# EAGLE schematic mother_card_cs_956pm (EAGLE 8.2.2)

## Sheet 1 of 2
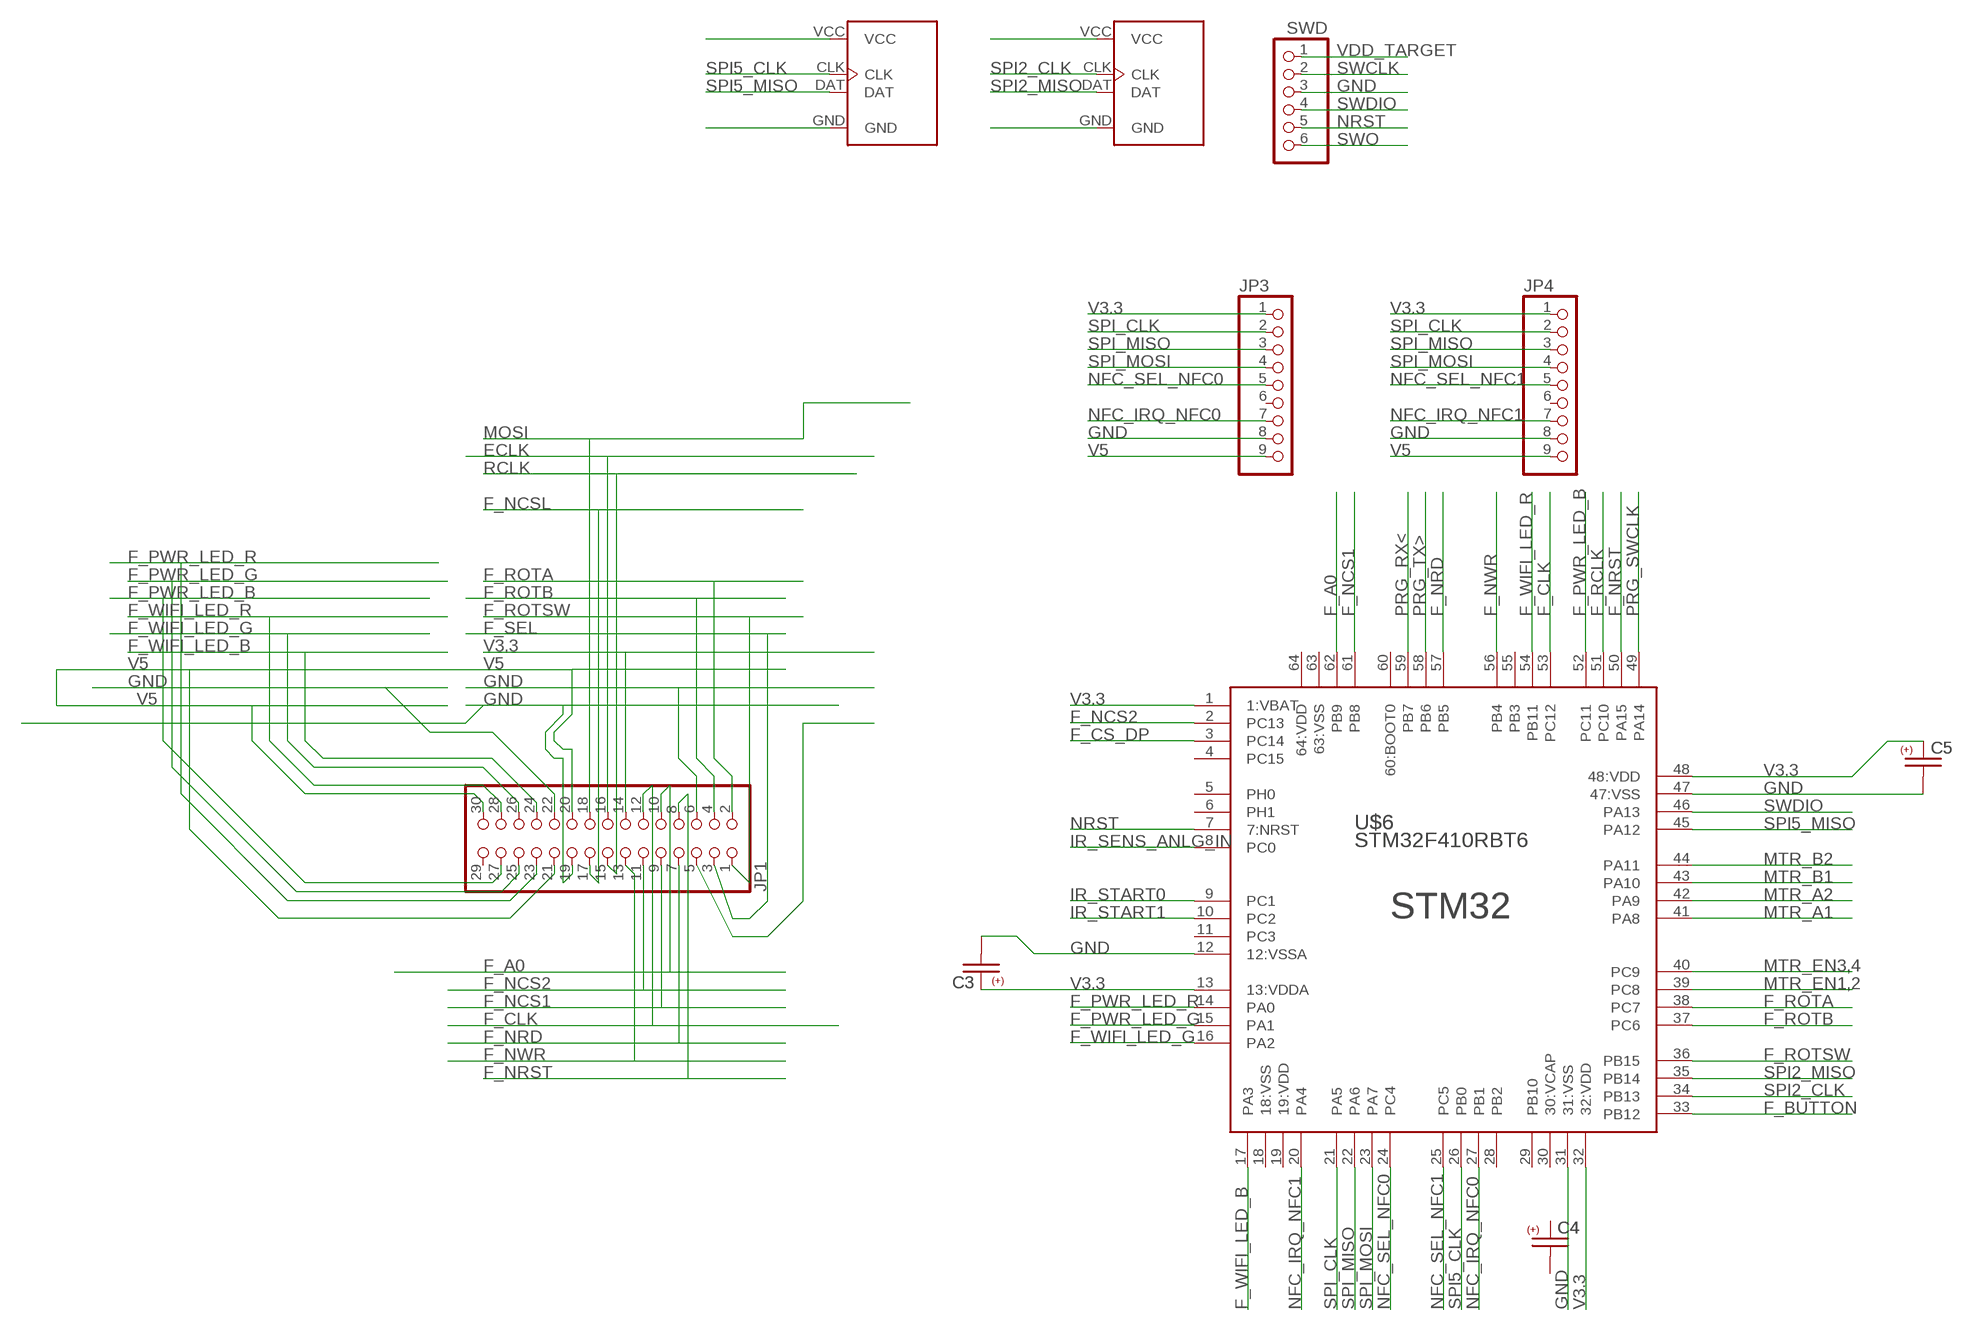
[diagram p0: schematic, sheet 1]

### Parts
C3  C-USC0805  [C0805]
C4  C-USC0805  [C0805]
C5  C-USC0805  [C0805]
JP1  PINHD-2X15/SOCK  [2X15/SOCK]
JP3  PINHD-1X9/90  [1X09/90]
JP4  PINHD-1X9/90  [1X09/90]
SWD  PINHD-1X6  [1X06]
U$1  HX711  [HX711]
U$2  HX711  [HX711]
U$6  STM32F410RBT6  [QFP50P1200X1200X160-64N]

### Nets
3V3B: JP1.5
ECLK: JP1.16
F_A0: JP1.10 U$6.62(PB9)
F_BUTTON: U$6.33(PB12)
F_CLK: JP1.12 U$6.53(PC12)
F_CS_DP: U$6.3(PC14)
F_NCS1: JP1.9 U$6.61(PB8)
F_NCS2: JP1.11 U$6.2(PC13)
F_NCSL: JP1.17
F_NRD: JP1.7 U$6.57(PB5)
F_NRST: JP1.8 U$6.50(PA15)
F_NWR: JP1.13 U$6.56(PB4)
F_PWR_LED_B: JP1.27 U$6.52(PC11)
F_PWR_LED_G: JP1.25 U$6.15(PA1)
F_PWR_LED_R: JP1.23 U$6.14(PA0)
F_RCLK: U$6.51(PC10)
F_ROTA: JP1.2 U$6.38(PC7)
F_ROTB: JP1.4 U$6.37(PC6)
F_ROTSW: JP1.1 U$6.36(PB15)
F_SEL: JP1.3
F_WIFI_LED_B: JP1.24 U$6.17(PA3)
F_WIFI_LED_G: JP1.26 U$6.16(PA2)
F_WIFI_LED_R: JP1.28 U$6.54(PB11)
GND: C3.2 C5.2 JP1.6 JP1.19 JP1.22 JP3.8 JP4.8 SWD.3 U$6.12(12:VSSA) U$6.31(31:VSS) U$6.47(47:VSS) ; also sheet 2
IR_SENS_ANLG_IN: U$6.8(PC0)
IR_START0: U$6.9(PC1)
IR_START1: U$6.10(PC2)
MOSI: JP1.18
MTR_A1: U$6.41(PA8) ; also sheet 2
MTR_A2: U$6.42(PA9) ; also sheet 2
MTR_B1: U$6.43(PA10) ; also sheet 2
MTR_B2: U$6.44(PA11) ; also sheet 2
MTR_EN1,2: U$6.39(PC8) ; also sheet 2
MTR_EN3,4: U$6.40(PC9) ; also sheet 2
N$6: U$1.GND
N$7: U$2.GND
N$8: U$2.VCC
N$9: U$1.VCC
NFC_IRQ_NFC0: JP3.7 U$6.27(PB1)
NFC_IRQ_NFC1: JP4.7 U$6.20(PA4)
NFC_SEL_NFC0: JP3.5 U$6.24(PC4)
NFC_SEL_NFC1: JP4.5 U$6.25(PC5)
NRST: SWD.5 U$6.7(7:NRST)
PRG_RX<: U$6.59(PB7)
PRG_SWCLK: U$6.49(PA14)
PRG_TX>: U$6.58(PB6)
RCLK: JP1.15
SPI2_CLK: U$2.CLK U$6.34(PB13)
SPI2_MISO: U$2.DAT U$6.35(PB14)
SPI5_CLK: U$1.CLK U$6.26(PB0)
SPI5_MISO: U$1.DAT U$6.45(PA12)
SPI_CLK: JP3.2 JP4.2 U$6.21(PA5)
SPI_MISO: JP3.3 JP4.3 U$6.22(PA6)
SPI_MOSI: JP3.4 JP4.4 U$6.23(PA7)
SWCLK: SWD.2
SWDIO: SWD.4 U$6.46(PA13)
SWO: SWD.6
V3.3: C3.1 C5.1 JP1.14 JP3.1 JP4.1 U$6.1(1:VBAT) U$6.13(13:VDDA) U$6.32(32:VDD) U$6.48(48:VDD) ; also sheet 2
V5: JP1.20 JP1.21 JP1.30 JP3.9 JP4.9 ; also sheet 2
VDD_TARGET: SWD.1
Unconnected: C4.1 C4.2 JP1.29 JP3.6 JP4.6 U$6.4(PC15) U$6.5(PH0) U$6.6(PH1) U$6.11(PC3) U$6.18(18:VSS) U$6.19(19:VDD) U$6.28(PB2) U$6.29(PB10) U$6.30(30:VCAP) U$6.55(PB3) U$6.60(60:BOOT0) U$6.63(63:VSS) U$6.64(64:VDD)

## Sheet 2 of 2
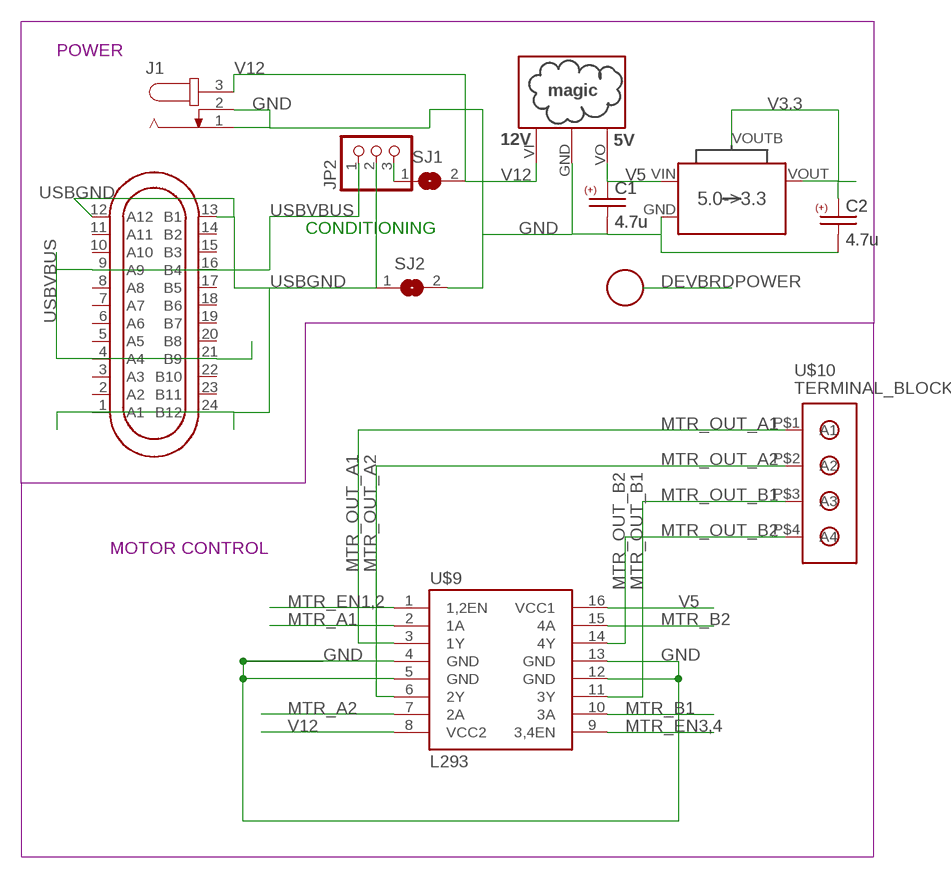
[diagram p1: schematic, sheet 2]

### Parts
C1  4.7u  C-USC0805  [C0805]
C2  4.7u  C-USC0805  [C0805]
J1  JACK-PLUG0  [SPC4077]
JP2  PINHD-1X3  [1X03]
SJ1  SJ  [SJ]
SJ2  SJ  [SJ]
U$4  OKI-78SR-W36  [SIP3]
U$7  USB-C-BRKOUT  [USB-C-BRKOUT]
U$8  AP2114H  [AP2114H]
U$9  L293  [DIL16]
U$10  TERMINAL_BLOCK  [1X4/BLOCK]

### Nets
GND: C1.2 C2.2 J1.1 J1.2 SJ2.2 U$4.GND U$8.GND U$9.4(GND) U$9.5(GND) U$9.12(GND) U$9.13(GND) ; also sheet 1
MTR_A1: U$9.2(1A) ; also sheet 1
MTR_A2: U$9.7(2A) ; also sheet 1
MTR_B1: U$9.10(3A) ; also sheet 1
MTR_B2: U$9.15(4A) ; also sheet 1
MTR_EN1,2: U$9.1(1,2EN) ; also sheet 1
MTR_EN3,4: U$9.9(3,4EN) ; also sheet 1
MTR_OUT_A1: U$9.3(1Y) U$10.P$1(A1)
MTR_OUT_A2: U$9.6(2Y) U$10.P$2(A2)
MTR_OUT_B1: U$9.11(3Y) U$10.P$3(A3)
MTR_OUT_B2: U$9.14(4Y) U$10.P$4(A4)
N$1: JP2.3 SJ1.1
USBGND: JP2.2 SJ2.1 U$7.1(A1) U$7.12(A12) U$7.13(B1) U$7.24(B12)
USBVBUS: JP2.1 U$7.4(A4) U$7.9(A9) U$7.16(B4) U$7.21(B9)
V3.3: C2.1 U$8.VOUT(VO) U$8.VOUTB(BODY) ; also sheet 1
V5: C1.1 U$4.VO U$8.VIN(VI) U$9.16(VCC1) ; also sheet 1
V12: J1.3 SJ1.2 U$4.VI U$9.8(VCC2)
Unconnected: U$7.2(A2) U$7.3(A3) U$7.5(A5) U$7.6(A6) U$7.7(A7) U$7.8(A8) U$7.10(A10) U$7.11(A11) U$7.14(B2) U$7.15(B3) U$7.17(B5) U$7.18(B6) U$7.19(B7) U$7.20(B8) U$7.22(B10) U$7.23(B11)

### Notes on the sheet
- POWER
- CONDITIONING
- MOTOR CONTROL

## Library data of the parts
C1-C5 = seniorDesign:C-US: CAPACITOR, American symbol
J1 = con-jack:JACK-PLUG: DC POWER JACK Power Jack, DC, Right Angle, Through Hole, Rated 5A at 16VDC, PC Terminals Distributor: Farnell (www.Farnell.de) Drawing: 84N1161.pdf / 84N1162.pdf Manufacturer: SPC Technology (www.spctechnology.com) Type: SPC4077 / SPC 4078; OC_FARNELL: unknown; OC_NEWARK: unknown
JP1 = csomers:PINHD-2X15: PIN HEADER, socket for parallel cable, IDC connector, On Shore Technology Inc.
JP2 = pinhead:PINHD-1X3: PIN HEADER
JP3 JP4 = pinhead:PINHD-1X9: PIN HEADER
SJ1 SJ2 = jumper:SJ: SMD solder JUMPER
SWD = pinhead:PINHD-1X6: PIN HEADER
U$1 U$2 = seniorDesign:HX711: old green circuit board rendition of HX711 load amplifier
U$4 = seniorDesign:OKI-78SR-W36
U$6 = seniorDesign:STM32F410RBT6: STMicroelectronics STM32F410RBT6 main microcontroller, motherboard http://www.st.com/.../content/translations/en.DM00214043.pdf <http://www.st.com/content/ccc/resource/technical/document/datasheet/6e/f3/b0/1b/05/eb/49/fe/DM00214043.pdf/files/DM00214043.pdf/jcr:content/translations/en.DM00214043.pdf>
U$7 = usb:USB-C-BRKOUT
U$8 = seniorDesign:AP2114: AP2114H-3.3TRG1DICT-ND 5V LDO, main 5V line, motherboard https://www.diodes.com/assets/Datasheets/AP2114.pdf
U$9 = seniorDesign:L293: L293 Stepper Motor Driver
U$10 = seniorDesign:TERMINAL_BLOCK: Terminal Block for stepper motor connections